# Altium schematic sheet CKLink_Lite.SchDoc
size A4; SheetNumber: 1; SheetTotal: 1
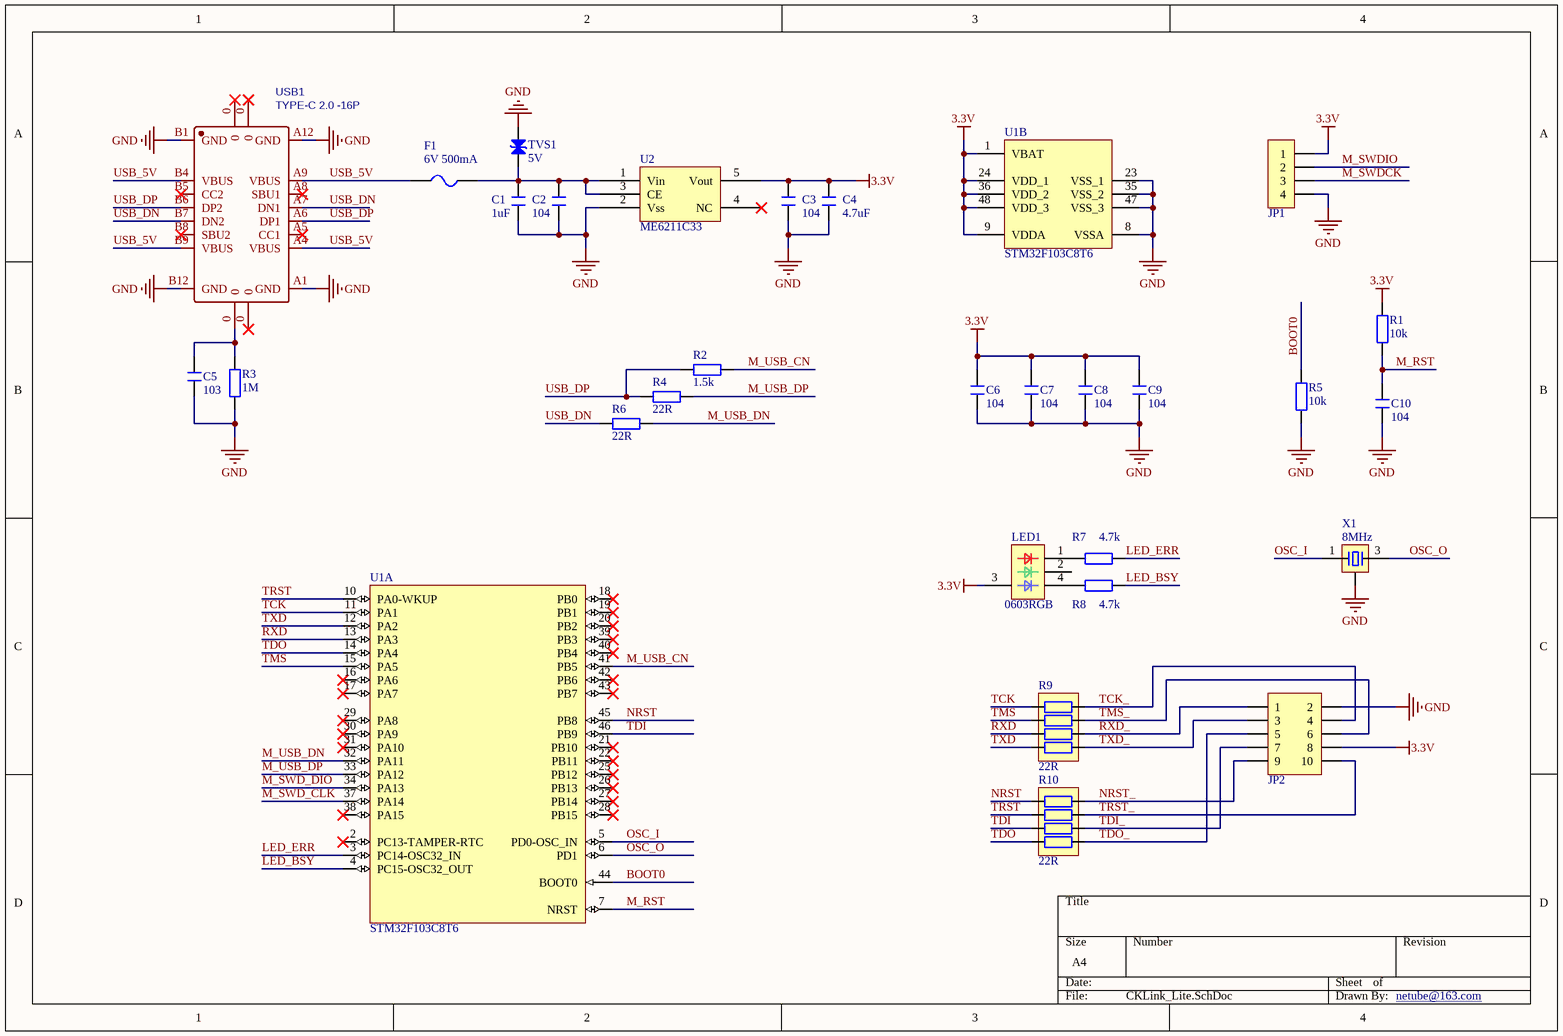
[diagram p0: CKLink_Lite.SchDoc]

## Parts
C1  1uF  [C 0603_L]
C2  104  [C 0603_L]
C3  104  [C 0603_L]
C4  4.7uF  [C 0603_L]
C5  103  [C 0603_L]
C6  104  [C 0603_L]
C7  104  [C 0603_L]
C8  104  [C 0603_L]
C9  104  [C 0603_L]
C10  104  [C 0603_L]
F1  6V 500mA  [FU 0805]
JP1  HDR-1X4  [HDR2.54-LI-4P]  (value not drawn)
JP2  Header 5X2  [CHE2*5]  (value not drawn)
LED1  0603RGB  [0603RGB]
R1  10k  [R 0603_L]
R2  1.5k  [R 0603_L]
R3  1M  [R 0603_L]
R4  22R  [R 0603_L]
R5  10k  [R 0603_L]
R6  22R  [R 0603_L]
R7  4.7k  [R 0603_L]
R8  4.7k  [R 0603_L]
R9  22R  [RCA-8P4R-0603]
R10  22R  [RCA-8P4R-0603]
TVS1  5V  [SOD-323]
U1  STM32F103C8T6  [LQFP48_L]  (parts A,B of 2)
U2  ME6211C33  [SOT23-5N]
USB1  TYPE-C 2.0 -16P  [USB-TYPE-C_16PIN-MALE-TYPE-C-31-M-12]
X1  8MHz  [CSTCE 3pin]

## Nets
3.3V: C3.2 C4.2 C6.2 C7.2 C8.2 C9.2 JP1.1 JP2.8 LED1.3(VCC) R1.2 U1.1(VBAT) U1.9(VDDA) U1.24(VDD_1) U1.36(VDD_2) U1.48(VDD_3) U2.5(Vout)
GND: C1.1 C2.1 C3.1 C4.1 C5.1 C6.1 C7.1 C8.1 C9.1 C10.1 JP1.4 JP2.2 R3.1 R5.1 TVS1.2(K) U1.8(VSSA) U1.23(VSS_1) U1.35(VSS_2) U1.47(VSS_3) U2.2(Vss) USB1.A1(GND) USB1.A12(GND) USB1.B1(GND) USB1.B12(GND) X1.2
BOOT0: R5.2 U1.44(BOOT0)
LED_BSY: R8.1 U1.4(PC15-OSC32_OUT)
LED_ERR: R7.1 U1.3(PC14-OSC32_IN)
M_RST: C10.2 R1.1 U1.7(NRST)
M_SWD_CLK: U1.37(PA14)
M_SWD_DIO: U1.34(PA13)
M_SWDCK: JP1.3
M_SWDIO: JP1.2
M_USB_CN: R2.1 U1.41(PB5)
M_USB_DN: R6.1 U1.32(PA11)
M_USB_DP: R4.1 U1.33(PA12)
NRST: R10.4 U1.45(PB8)
NRST_: JP2.9 R10.5
OSC_I: U1.5(PD0-OSC_IN) X1.1
OSC_O: U1.6(PD1) X1.3
RXD: R9.3 U1.13(PA3)
RXD_: JP2.1 R9.6
TCK: R9.1 U1.11(PA1)
TCK_: JP2.4 R9.8
TDI: R10.2 U1.46(PB9)
TDI_: JP2.7 R10.7
TDO: R10.1 U1.14(PA4)
TDO_: JP2.5 R10.8
TMS: R9.2 U1.15(PA5)
TMS_: JP2.6 R9.7
TRST: R10.3 U1.10(PA0-WKUP)
TRST_: JP2.10 R10.6
TXD: R9.4 U1.12(PA2)
TXD_: JP2.3 R9.5
USB_5V: F1.1 USB1.A4(VBUS) USB1.A9(VBUS) USB1.B4(VBUS) USB1.B9(VBUS)
USB_DN: R6.2 USB1.A7(DN1) USB1.B7(DN2)
USB_DP: R2.2 R4.2 USB1.A6(DP1) USB1.B6(DP2)
NetC1_2: C1.2 C2.2 F1.2 TVS1.1(A) U2.1(Vin) U2.3(CE)
NetC5_2: C5.2 R3.2 USB1.0
NetLED1_1: LED1.1(R) R7.2
NetLED1_4: LED1.4(B) R8.2

Not connected (* = marked no-connect by the designer): LED1 2(G); U1 2(PC13-TAMPER-RTC)* 16(PA6)* 17(PA7)* 18(PB0)* 19(PB1)* 20(PB2)* 21(PB10)* 22(PB11)* 25(PB12)* 26(PB13)* 27(PB14)* 28(PB15)* 29(PA8)* 30(PA9)* 31(PA10)* 38(PA15)* 39(PB3)* 40(PB4)* 42(PB6)* 43(PB7)*; U2 4(NC)*; USB1 A5(CC1)* A8(SBU1)* B5(CC2)* B8(SBU2)*

## Notes on the sheet
- netube@163.com <https://space.bilibili.com/38208741>

## Library data of the parts
C1-C10 = C: 贴片电容; BOM名称: 无极性贴片电容; 优秀评价可免费更新: 联系淘宝ID：黄晶宝石，获取更新版封装库; 卖家免费技术支持，联系售后: 唯一出售店铺网址https://shop463601444.taobao.com; 本封装库来自淘宝卖家 ID：黄晶宝石: 其他店铺购入均为盗版，请立即申请退款
F1 = FU: 贴片保险丝; 版权归属: 封装库来自淘宝卖家 ID：黄晶宝石; 优秀评价可免费更新: 联系淘宝ID：黄晶宝石，获取更新版封装库; 卖家免费技术支持，联系售后: 唯一出售店铺网址https://shop463601444.taobao.com; 封装库来自淘宝卖家 ID：黄晶宝石: 其他店铺购入均为盗版，请立即申请退款; BOM名称: 贴片保险丝
JP1 = Header 4: 4P接插件; 版权归属: 封装库来自淘宝 ID：黄晶宝石; 优秀评价可免费更新: 联系淘宝ID：黄晶宝石，获取更新版封装库; 卖家免费技术支持，联系售后: 唯一出售店铺网址https://shop463601444.taobao.com; BOM名称: 4P接插件
JP2 = Header 5X2: 5*2P接插件; 版权归属: 封装库来自淘宝 ID：黄晶宝石; 优秀评价可免费更新: 联系淘宝ID：黄晶宝石，获取更新版封装库; 卖家免费技术支持，联系售后: 唯一出售店铺网址https://shop463601444.taobao.com; BOM名称: 5*2P接插件
R1-R8 = R: 贴片电阻; 优秀评价可免费更新: 联系淘宝ID：黄晶宝石，获取更新版封装库; 卖家免费技术支持，联系售后: 唯一出售店铺网址https://shop463601444.taobao.com; 本封装库来自淘宝卖家 ID：黄晶宝石: 其他店铺购入均为盗版，请立即申请退款; BOM名称: 贴片电阻
R9 R10 = R-8P4R: 贴片排阻; BOM名称: 贴片网络排阻; 优秀评价可免费更新: 联系淘宝ID：黄晶宝石，获取更新版封装库; 卖家免费技术支持，联系售后: 唯一出售店铺网址https://shop463601444.taobao.com; 本封装库来自淘宝卖家 ID：黄晶宝石: 其他店铺购入均为盗版，请立即申请退款
TVS1 = TVS: TVS保护; 卖家免费技术支持，联系售后: 唯一出售店铺网址https://shop463601444.taobao.com; 优秀评价可免费更新: 联系淘宝ID：黄晶宝石，获取更新版封装库; 封装库 来自淘宝卖家 ID：黄晶宝石: 其他店铺购入均为盗版，请立即申请退款; Code_JEDEC: DO-214-AB
U1 = STM32F103C8T6: STM32 ARM-based 32-bit MCU Performance Line with 64 kB Flash, 20 kB Internal RAM, -40 to +85癈 Temperature, 48-Pin LQFP, Tray; 优秀评价可免费更新: 联系淘宝ID：黄晶宝石，获取更新版封装库; 卖家免费技术支持，联系售后: 唯一出售店铺网址https://shop463601444.taobao.com; 封装库来自淘宝卖家 ID：黄晶宝石: 其他店铺购入均为假冒，请申请退款，本店现金奖励; DatasheetVersion: rev13.0, Apr-2011; PackageVersion: rev13, Apr-2011; PackageReference: LQFP48; PackageDescription: 48-Pin Low-Profile Quad Flat Pack, 7 x 7 mm Body, 0.5 mm Pitch (LQFP48)
U2 = ME6211C33: 3.3V 500mA 低压差线性稳压器
USB1 = USB2.0 Type-C 16Pin母座: USB2.0 Type-C 母座 16Pin; BOM_Manufacturer: LCSC; BOM_Supplier: LCSC; BOM_Manufacturer Part: -; spicePre: U; spiceSymbolName: TYPE-C 3.1 -16P_C168689
X1 = XTAL-3P: 3脚无源晶振; BOM名称: 4脚无源晶振; 版权归属: 封装库来自淘宝卖家 ID：黄晶宝石; 优秀评价可免费更新: 联系淘宝ID：黄晶宝石，获取更新版封装库; 卖家免费技术支持，联系售后: 唯一出售店铺网址https://shop463601444.taobao.com; 封装库来自淘宝卖家 ID：黄晶宝石: 其他店铺购入均为盗版，请立即申请退款